# EAGLE design Temperatursensor_1.1 (EAGLE 5.04)
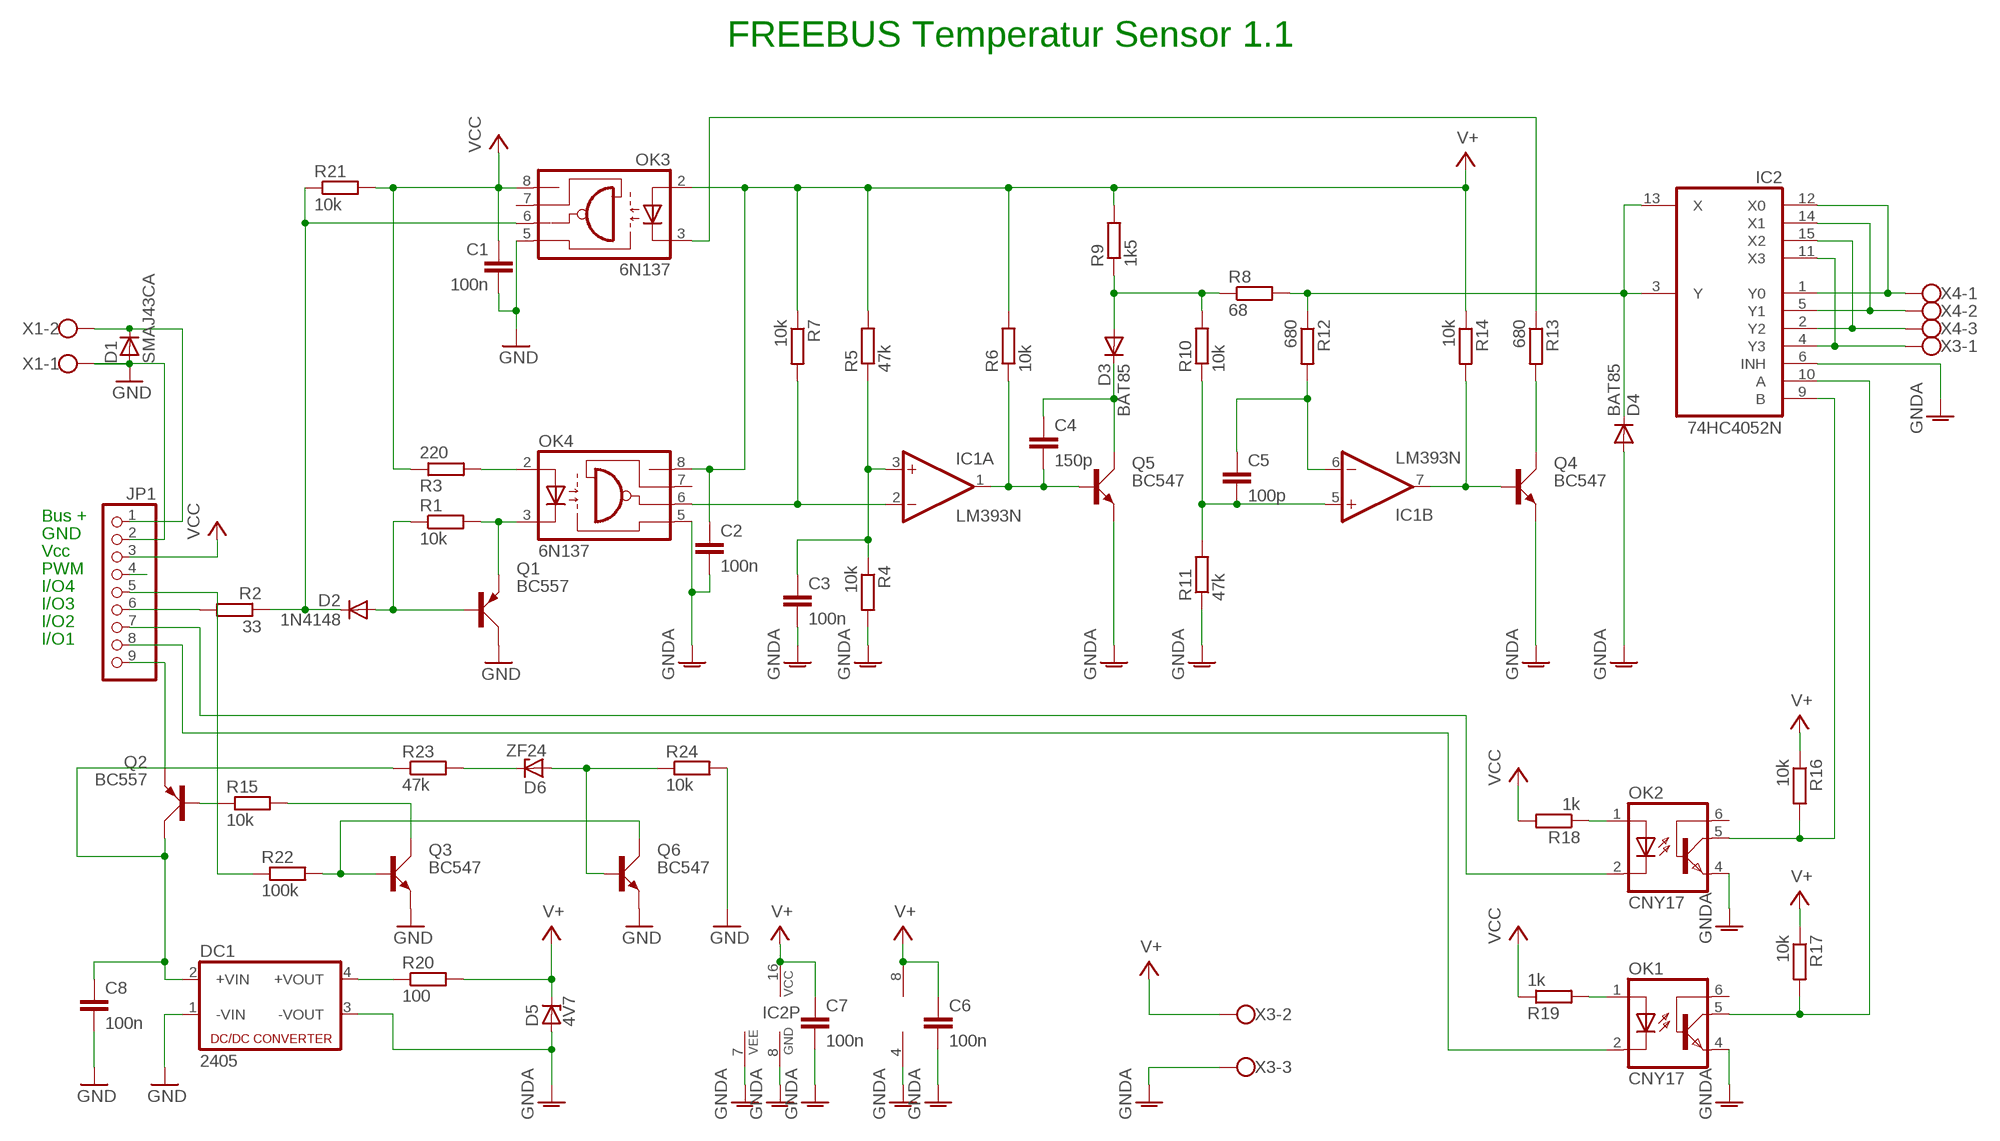
[diagram p0: schematic, sheet 1]

## Parts
C1  100n  C-EU025-024X044  [C025-024X044]
C2  100n  C-EU025-024X044  [C025-024X044]
C3  100n  C-EU025-024X044  [C025-024X044]
C4  150p  C-EU025-024X044  [C025-024X044]
C5  100p  C-EU025-024X044  [C025-024X044]
C6  100n  C-EU025-024X044  [C025-024X044]
C7  100n  C-EU025-024X044  [C025-024X044]
C8  100n  C-EU025-024X044  [C025-024X044]
D1  SMAJ43CA  D-SMB  [SMB]
D2  1N4148  DIODE-D-2.5  [D-2.5]
D3  BAT85  DIODE-D-2.5  [D-2.5]
D4  BAT85  DIODE-D-7.5  [D-7.5]
D5  4V7  ZPDSTEHEND  [ZDIODE]
D6  ZF24  ZPD  [DO35Z10]
DC1  2405  NME  [NME]
IC1  LM393N  [DIL08]
IC2  74HC4052N  4052N  [DIL16]
JP1  PINHD-1X9  [1X09]
OK1  CNY17  [DIL06]
OK2  CNY17  [DIL06]
OK3  6N137  HCPL2601  [DIL08]
OK4  6N137  HCPL2601  [DIL08]
Q1  BC557  [SOT54A]
Q2  BC557  [SOT54A]
Q3  BC547  [SOT54A]
Q4  BC547  [SOT54A]
Q5  BC547  [SOT54A]
Q6  BC547  [SOT54A]
R1  10k  R-EU_0207/2V  [0207/2V]
R2  33  R-EU_0207/2V  [0207/2V]
R3  220  R-EU_0207/2V  [0207/2V]
R4  10k  R-EU_0207/2V  [0207/2V]
R5  47k  R-EU_0207/2V  [0207/2V]
R6  10k  R-EU_0207/2V  [0207/2V]
R7  10k  R-EU_0207/2V  [0207/2V]
R8  68  R-EU_0207/2V  [0207/2V]
R9  1k5  R-EU_0207/2V  [0207/2V]
R10  10k  R-EU_0207/2V  [0207/2V]
R11  47k  R-EU_0207/2V  [0207/2V]
R12  680  R-EU_0207/2V  [0207/2V]
R13  680  R-EU_0207/2V  [0207/2V]
R14  10k  R-EU_0207/2V  [0207/2V]
R15  10k  R-EU_0207/2V  [0207/2V]
R16  10k  R-EU_0207/2V  [0207/2V]
R17  10k  R-EU_0207/2V  [0207/2V]
R18  1k  R-EU_0207/2V  [0207/2V]
R19  1k  R-EU_0207/2V  [0207/2V]
R20  100  R-EU_0207/2V  [0207/2V]
R21  10k  R-EU_0207/2V  [0207/2V]
R22  100k  R-EU_0207/2V  [0207/2V]
R23  47k  R-EU_0207/2V  [0207/2V]
R24  10k  R-EU_0207/2V  [0207/2V]
X1  W237-02P  [W237-132]
X3  W237-3E  [W237-3E]
X4  W237-3E  [W237-3E]

## Nets
GND: C1.2 C8.2 D1.2(A) DC1.1(-VIN) JP1.2 OK3.5(GND) Q1.C Q3.E Q6.E R24.2 X1.1
GNDA: C2.2 C3.2 C6.2 C7.2 D4.A D5.A DC1.3(-VOUT) IC1.4(P:V-) IC2.6(INH) IC2.7(VEE) IC2.8(GND) OK1.4(EMI) OK2.4(EMI) OK4.5(GND) Q4.E Q5.E R4.2 R11.1 X3.3
IO1: JP1.8 OK1.2(C)
IO2: JP1.7 OK2.2(C)
IO3: JP1.6 R2.2
IO4: JP1.5 R22.1
N$1: OK4.2(A) R3.2
N$2: OK4.3(C) Q1.E R1.2
N$3: D2.A Q1.B R1.1
N$4: D1.1(C) JP1.1 X1.2
N$5: D2.C OK3.6(OUT) R2.1 R21.1
N$6: IC2.1(Y0) IC2.12(X0) X4.1
N$7: IC1.2(A:-IN) OK4.6(OUT) R7.2
N$8: C8.1 DC1.2(+VIN) Q2.C R23.1
N$9: D4.C IC2.3(Y) IC2.13(X) R8.2 R12.1
N$10: D3.A R8.1 R9.1 R10.2
N$11: C3.1 IC1.3(A:+IN) R4.1 R5.1
N$12: IC2.5(Y1) IC2.14(X1) X4.2
N$13: C5.2 IC1.5(B:+IN) R10.1 R11.2
N$14: C4.2 IC1.1(A:OUT) Q5.B R6.1
N$15: C4.1 D3.C Q5.C
N$17: IC2.2(Y2) IC2.15(X2) X4.3
N$18: Q2.B R15.1
N$19: C5.1 IC1.6(B:-IN) R12.2
N$20: IC2.4(Y3) IC2.11(X3) X3.1
N$21: IC1.7(B:OUT) Q4.B R14.2
N$22: OK3.3(C) R13.1
N$23: Q4.C R13.2
N$24: IC2.9(B) OK2.5(COL) R16.2
N$25: IC2.10(A) OK1.5(COL) R17.2
N$26: Q3.C R15.2
N$27: OK2.1(A) R18.1
N$28: OK1.1(A) R19.2
N$29: DC1.4(+VOUT) R20.1
N$30: Q3.B Q6.C R22.2
N$31: D6.C R23.2
N$32: D6.A Q6.B R24.1
PWM: JP1.4
V+: C2.1 C6.1 C7.1 D5.C IC1.8(P:V+) IC2.16(VCC) OK3.2(A) OK4.8(VCC) R5.2 R6.2 R7.1 R9.2 R14.1 R16.1 R17.1 R20.2 X3.2
VCC: C1.1 JP1.3 OK3.8(VCC) R3.1 R18.2 R19.1 R21.2
VDD_IN: JP1.9 Q2.E
Unconnected: OK1.6(BAS) OK2.6(BAS) OK3.7(EN) OK4.7(EN)

## Notes on the sheet
- FREEBUS Temperatur Sensor 1.1
- Bus +
- GND
- Vcc
- PWM
- I/O4
- I/O3
- I/O2
- I/O1

## Library data of the parts
C1-C8 = resistor:C-EU: CAPACITOR, European symbol
D1 = semicon-smd-ipc:D-: DIODE unfilled
D2-D4 = diode:DIODE-: DIODE
D5 D6 = diode:ZPD: Z DIODE 500 mW
DC1 = dc-dc-converter:NME: DC-DC CONVERTER
IC1 = linear:LM393: COMPARATOR
IC2 = 40xx:4052: Dual 4-channel ANALOG MULTIPLEXER
JP1 = pinhead:PINHD-1X9: PIN HEADER
OK1 OK2 = optocoupler:CNY17: SIEMENS OPTO COUPLER
OK3 OK4 = optocoupler:HCPL2601: HEWLETT PACKARD OPTO COUPLER
Q1 Q2 = transistor-small-signal:BC557: PNP TRANSISTOR
Q3-Q6 = transistor-small-signal:BC547: NPN TRANSISTOR
R1-R24 = resistor:R-EU_: RESISTOR, European symbol
X1 = con-wago-508:W237-02P: WAGO SREW CLAMP
X3 X4 = con-wago-508:W237-3E: WAGO SREW CLAMP

## Board
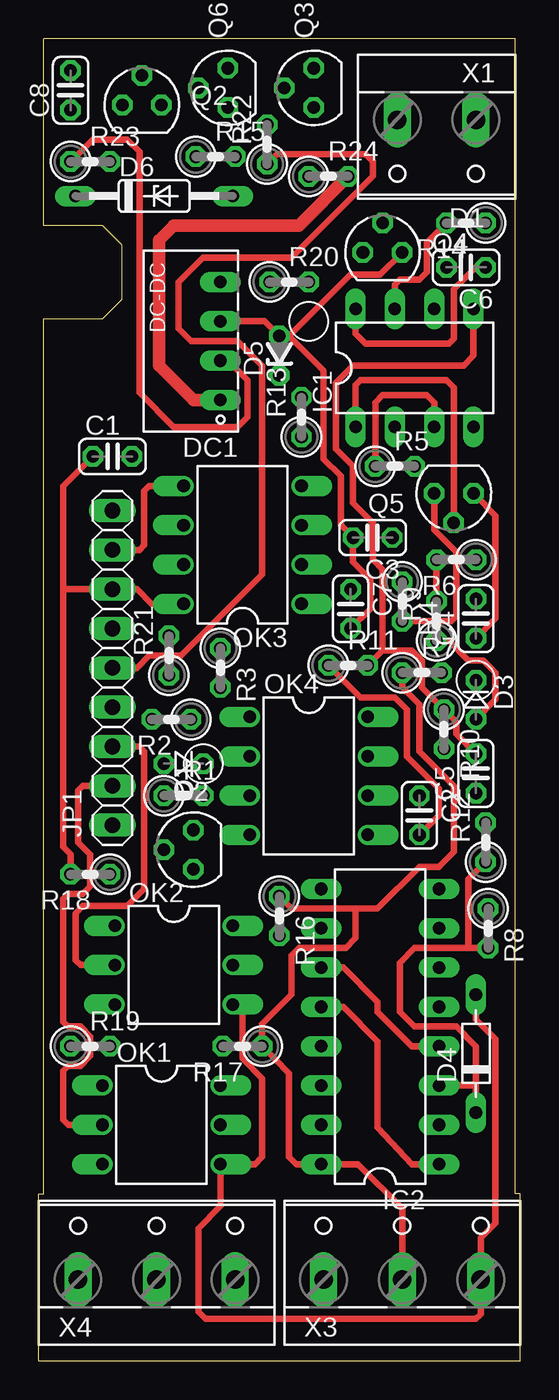
[diagram p1: board, top side]
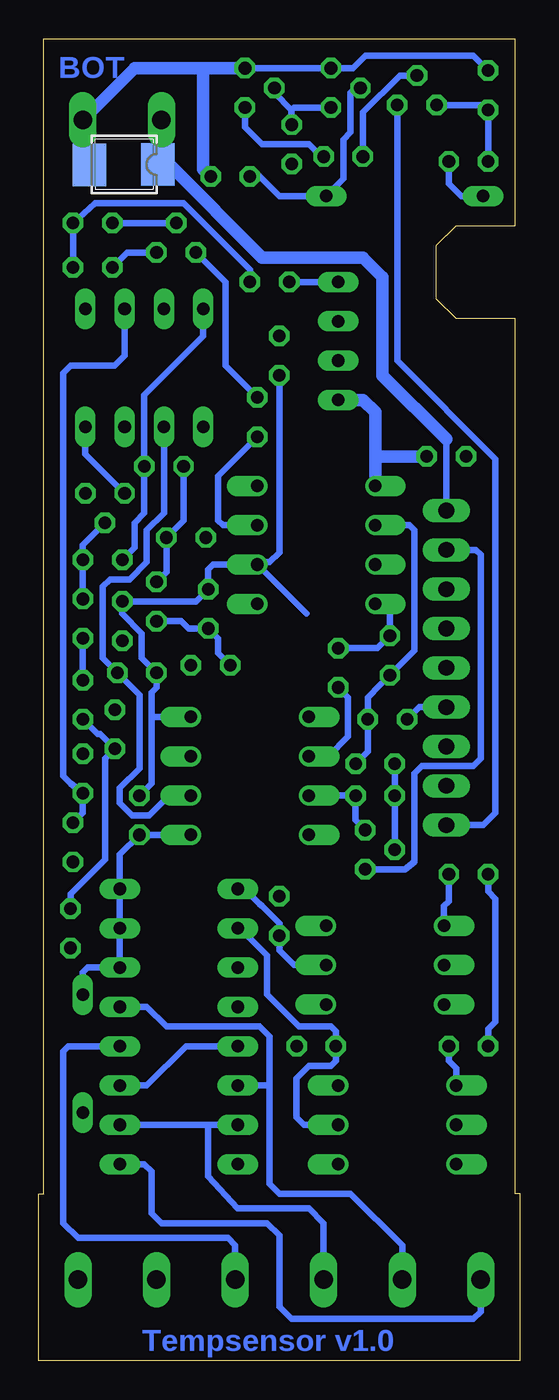
[diagram p2: board, bottom side, seen from below]

Size 31.11 x 85.41 mm. Coordinates in mm from the lower left corner, seen from the top.
Outline: 0,0 0,10.79 0.32,10.79 0.32,67.31 4.13,67.31 5.4,68.58 5.4,72.07 4.13,73.34 0.32,73.34 0.32,85.41 30.8,85.41 30.8,10.79 31.11,10.79 31.11,0 0,0
Copper layers (1*16): Top 0.035mm / dielectric 1.5mm / Bottom 0.035mm
Design rules "default *": minimum track width 10mil, minimum drill 24mil, track to track 12mil, track to pad 12mil, pad to pad 12mil, via to via 12mil, smd to smd 8mil, copper to edge 40mil, drill to drill 8mil, minimum pad ring 10mil, minimum via ring 8mil, stop-mask expansion 4mil, vias tented up to drill 0mil, thermal gap 10mil

### Footprints (pad centres in the part's own frame; a part is rotated, then mirrored left to right if it is on the bottom)
C025-024X044 = drill 0.813 octagon: 1 -1.27,0; 2 1.27,0
SMB = smd 2.159 x 2.743: 1 -2.311,-0.127; 2 2.108,-0.102
D-2.5 = drill 0.813 octagon: A 1.27,0; C -1.27,0
D-7.5 = drill 0.813 long: A 3.81,0; C -3.81,0
ZDIODE = drill 0.813 octagon: A 1.27,0; C -1.27,0
DO35Z10 = drill 0.813 long: A 5.08,0; C -5.08,0
NME = drill 0.813 long: 1 0,3.81; 2 0,1.27; 3 0,-1.27; 4 0,-3.81
DIL08 = drill 0.813 long: 1 -3.81,-3.81; 2 -1.27,-3.81; 3 1.27,-3.81; 4 3.81,-3.81; 5 3.81,3.81; 6 1.27,3.81; 7 -1.27,3.81; 8 -3.81,3.81
DIL16 = drill 0.813 long: 1 -8.89,-3.81; 2 -6.35,-3.81; 3 -3.81,-3.81; 4 -1.27,-3.81; 5 1.27,-3.81; 6 3.81,-3.81; 7 6.35,-3.81; 8 8.89,-3.81; 9 8.89,3.81; 10 6.35,3.81; 11 3.81,3.81; 12 1.27,3.81; 13 -1.27,3.81; 14 -3.81,3.81; 15 -6.35,3.81; 16 -8.89,3.81
1X09 = drill 1.016 long: 1 -10.16,0; 2 -7.62,0; 3 -5.08,0; 4 -2.54,0; 5 0,0; 6 2.54,0; 7 5.08,0; 8 7.62,0; 9 10.16,0
DIL06 = drill 0.813 offset: 1 -2.54,-3.81; 2 0,-3.81; 3 2.54,-3.81; 4 2.54,3.81; 5 0,3.81; 6 -2.54,3.81
DIL08' = drill 0.813 offset: 1 -3.81,-3.81; 2 -1.27,-3.81; 3 1.27,-3.81; 4 3.81,-3.81; 5 3.81,3.81; 6 1.27,3.81; 7 -1.27,3.81; 8 -3.81,3.81
SOT54A = drill 0.813 octagon: B 0,1.905; C -1.27,0; E 1.27,0
0207/2V = drill 0.813 octagon: 1 -1.27,0; 2 1.27,0
W237-132 = drill 1.194 long: 1 -2.54,-0.635; 2 2.54,-0.635
W237-3E = drill 1.194 long: 1 -5.08,-0.635; 2 0,-0.635; 3 5.08,-0.635

### Placement (x,y rotation side)
C1  4.76,58.42 0 top
C2  24.61,35.24 270 top
C3  21.59,53.18 180 top
C4  28.26,47.94 90 top
C5  28.26,37.94 90 top
C6  27.62,70.64 180 top
C7  20.16,48.58 270 top
C8  2.06,82.07 90 top
D1  25.72,77.15 180 bottom
D2  9.37,38.58 180 top
D3  28.26,42.7 270 top
D4  28.26,19.84 90 top
D5  15.56,64.93 90 top
D6  7.46,75.25 0 top
DC1  11.75,65.88 180 top
IC1  24.29,64.14 0 top
IC2  22.07,21.59 90 top
JP1  4.76,44.77 270 top
OK1  7.94,15.24 270 top
OK2  8.73,25.56 270 top
OK3  6N137  [DIL08']  13.18,52.71 90 top
OK4  6N137  [DIL08']  17.46,37.78 270 top
Q1  10,33.02 90 top
Q2  6.67,81.12 0 top
Q3  17.78,82.23 90 top
Q4  22.22,71.6 0 top
Q5  26.83,56.04 180 top
Q6  12.22,82.23 90 top
R1  9.37,36.51 0 top
R2  8.57,41.43 180 top
R3  11.75,44.77 270 top
R4  23.5,49.05 270 top
R5  23.02,57.79 0 top
R6  26.99,51.75 180 top
R7  24.76,44.45 0 top
R8  29.05,27.94 270 top
R9  25.72,47.78 90 top
R10  26.19,40.8 270 top
R11  20,44.93 0 top
R12  28.89,33.5 90 top
R13  16.99,60.96 90 top
R14  27.62,73.5 180 top
R15  11.43,77.79 0 top
R16  15.56,28.73 270 top
R17  13.18,20.32 180 top
R18  3.33,31.43 180 top
R19  3.33,20.32 0 top
R20  16.19,69.69 0 top
R21  8.41,45.56 90 top
R22  14.76,78.58 90 top
R23  3.33,77.47 0 top
R24  18.73,76.52 0 top
X1  25.72,79.53 180 top
X3  23.49,5.87 0 top
X4  7.62,5.87 0 top

### Tracks (layer width: path | path; a pad name or v marks a point on that pad's centre or on a via)
GND
  Top 0.406: JP1.2 6.51,52.39 6.83,52.71 6.83,56.2 7.14,56.52 OK3.5
  Top 0.813: DC1.1 10,62.07 7.78,64.29 7.78,72.39 8.73,73.34 16.83,73.34 R24.2
  Bottom 0.406: Q1.C 7.46,31.75 6.83,32.23 6.83,35.08 6.83,35.4 6.83,36.67 6.83,37.94 6.35,38.42 3.02,38.42 2.54,38.89 2.54,52.07 2.86,52.39 JP1.2 | X1.1 27.83,80.17 D1.2 27.83,80.6 | Q3.E Q6.E 10.8,83.5 10,84.3 3.02,84.3 C8.2
  Bottom 0.813: 9.37,58.42 C1.2 | 9.37,58.42 9.37,61.28 10.16,62.07 DC1.1 | OK3.5 9.37,58.42 | 27.83,80.6 24.92,83.5 20.48,83.5 | 20.48,83.5 Q3.E | 20.48,83.5 20.48,76.99 R24.2
GNDA
  Top 0.406: C7.2 21.43,48.58 21.43,50.48 20.32,51.59 C3.2 19.53,53.98 19.53,57.15 18.42,58.26 18.42,63.66 18.42,63.98 16.19,66.2 | R4.2 26.67,47.78 26.99,48.1 26.99,52.23 25.56,53.66 Q5.E | 18.42,68.42 20.16,70.17 22.07,70.17 Q4.E | Q4.E | C2.2 25.88,35.24 25.88,36.99 23.81,39.05 | 23.81,39.05 | 23.81,39.05 | 23.81,39.05 | 23.81,39.05 23.81,42.07 23.02,42.86 20.8,42.86 R11.1 | R11.1 | R11.1 | OK2.4 13.18,23.02 13.18,22.86 13.18,22.7 13.18,19.53 14.45,18.26 14.45,13.18 13.97,12.7 OK1.4 11.75,10 10.32,8.57 10.32,3.17 10.79,2.7 28.26,2.7 28.58,3.02 X3.3 28.58,7.94 29.53,8.89 29.53,20.8 28.26,22.07 28.26,23.34 D4.A | 16.19,66.2 | 16.19,66.2 D5.A 14.6,67.15 DC1.3 | DC1.3 | 18.42,68.42 | 16.19,66.2 18.42,68.42
  Bottom 0.406: OK4.5 24.45,33.97 C2.2 | C2.2 | IC2.8 25.88,32.7 C2.2 | R4.2 21.91,47.78 21.43,47.31 C7.2 19.53,46.67 19.53,45.72 R11.1 | Q4.E | C6.2 25.4,71.6 Q4.E | IC2.8 | IC2.7 IC2.8 | IC2.6 | IC2.7 | IC2.6 IC2.7 | IC2.6 27.94,25.4 28.26,25.08 D4.A | D4.A | Q5.E | Q5.E 28.1,58.58 IC1.4
IO1
  Top 0.406: JP1.8 2.86,37.15 2.54,36.83 2.54,33.5 3.33,32.7 3.33,30.64 2.86,30.16 1.9,30.16 1.59,29.84 1.59,21.91 1.9,21.59 2.7,21.59 3.33,20.95 3.33,19.68 2.7,19.05 1.9,19.05 1.59,18.73 1.59,15.56 1.9,15.24 OK1.2
IO2
  Top 0.406: JP1.7 6.51,39.69 6.83,39.37 6.83,30.48 5.71,29.37 2.86,29.37 2.38,28.89 2.38,25.88 2.7,25.56 4.13,25.56 OK2.2
IO3
  Bottom 0.406: R2.2 6.51,42.23 JP1.6 | R2.2
IO4
  Top 0.406: JP1.5 6.35,44.77 7.14,45.56 9.21,45.56 14.45,50.8 14.45,64.29 12.86,65.88 9.84,65.88 9.05,66.67 9.05,69.69 10.64,71.28 16.35,71.28 21.59,76.52 21.59,77.47 21.11,77.95 15.4,77.95 R22.1
N$1
  Bottom 0.406: OK4.2 12.38,39.05 11.11,40.32 11.11,42.86 R3.2 | R3.2
N$2
  Bottom 0.406: OK4.3 10.79,36.51 R1.2 | R1.2 | R1.2 10.64,34.92 Q1.E
N$3
  Bottom 0.406: Q1.B 8.1,37.47 | D2.A 8.1,37.78 8.1,37.47 | 8.1,37.47 R1.1
N$4
  Bottom 0.406: X1.2 23.41,80.17 D1.1 23.37,77.31 22.7,77.31 | JP1.1 4.76,59.53
  Bottom 0.813: 4.76,59.53 8.89,63.66 8.89,70.01 10.16,71.28 16.67,71.28 22.7,77.31
N$5
  Bottom 0.406: D2.C 9.84,39.37 9.84,40.48 R2.1 | OK3.6 7.14,53.98 6.83,53.66 6.83,45.88 6.99,45.72 R21.1 9.05,43.66 9.84,42.86 R2.1 | R2.1
N$6
  Top 0.406: IC2.1 24.13,12.7 21.91,15.08 21.91,20.64 19.68,22.86 IC2.12
  Bottom 0.406: X4.1 2.54,3.17 3.02,2.7 14.76,2.7 15.56,3.49 15.56,8.1 16.35,8.89 23.18,8.89 23.81,9.53 23.81,12.22 24.29,12.7 IC2.1 | IC2.1
N$7
  Bottom 0.406: OK4.6 | OK4.6 | OK4.6 22.7,36.51 23.97,35.24 25.08,35.24 25.88,36.04 25.88,36.99 24.61,38.26 24.61,43.02 R7.2 26.99,45.4 26.99,50.01 26.51,50.48 25.24,50.48 24.13,51.59 24.13,53.66 23.02,54.77 23.02,56.83 23.02,57.94 IC1.2
N$8
  Top 0.406: DC1.2 12.22,64.61 13.49,63.34 13.49,60.96 12.86,60.33 8.73,60.33 6.51,62.55 6.51,78.11 5.71,78.9 3.49,78.9 R23.1
  Bottom 0.406: R23.1 C8.1 2.38,81.12 Q2.C | R23.1
N$9
  Top 0.406: IC2.3 28.26,17.78 | 28.26,17.78 D4.C | D4.C | 28.26,17.78 28.26,20.32 26.99,21.59 24.29,21.59 23.34,22.54 23.34,25.72 24.29,26.67 26.99,26.67 27.62,26.67 R8.2 | R8.2 | R12.1 27.78,31.11 27.78,26.67 R8.2 | R8.2 | R8.2 | R8.2
  Bottom 0.406: IC2.3 24.13,17.78 21.59,20.32 IC2.13
N$10
  Top 0.406: R9.1 26.51,46.51 27.78,45.24 28.58,45.24 28.73,45.24 29.53,44.45 29.53,42.7 D3.A
  Bottom 0.406: D3.A 27.3,40.48 27.15,40.48 26.83,40.16 R10.2 26.83,38.89 26.83,35.88 | R8.1 29.05,30.16 27.78,31.43 26.83,32.38 26.83,35.88 | 26.83,35.88 26.83,35.56
N$11
  Top 0.406: R5.1 21.75,61.91 22.22,62.39 22.38,62.39 25.08,62.39 25.56,61.91 IC1.3
  Bottom 0.406: R4.1 22.86,50.96 C3.1 21.75,54.29 R5.1
N$12
  Bottom 0.406: X4.2 7.62,7.46 10.95,10.79 15.56,10.79 16.19,11.43 16.19,17.78 | 16.19,17.78 IC2.14 | IC2.5 24.13,22.86 22.86,21.59 16.83,21.59 16.19,20.95 16.19,17.78
N$13
  Top 0.406: 22.22,45.88 22.22,51.12 21.59,51.75 21.59,54.13 | 21.59,54.13 | 21.59,54.13 20.32,55.4 20.32,57.79 19.21,58.9 19.21,63.18 20.32,64.29 27.46,64.29 28.1,64.93 IC1.5 | C5.2 | C5.2 26.99,40.48 26.99,41.28 R10.1 25.4,42.86 | 25.4,42.86 | 25.4,42.86 24.77,43.5 24.77,45.24 24.13,45.88 22.22,45.88 | 22.22,45.88 R11.2 | 22.22,45.88
N$14
  Top 0.406: Q5.B 26.83,56.2 26.83,58.26 26.83,62.87 26.35,63.34 20.8,63.34 20.48,63.02 IC1.1
  Bottom 0.406: R6.1 28.26,49.85 C4.2 | R6.1 | R6.1 28.26,52.71 27.78,53.18 Q5.B
N$15
  Top 0.406: C4.1 29.53,47.94 29.53,48.26 29.53,54.61 28.26,55.88 | 28.26,55.88 Q5.C | 28.26,55.88
  Bottom 0.406: D3.C 28.26,44.45 C4.1
N$17
  Bottom 0.406: IC2.2 | 20.16,15.24 IC2.15 | 20.16,15.24 IC2.2 | X4.3 12.7,8.89 13.65,9.84 18.26,9.84 20.16,11.91 20.16,15.24
N$18
  Bottom 0.406: Q2.B 7.78,83.03 10.16,80.64 R15.1
N$19
  Bottom 0.406: IC1.6 25.56,64.93 26.19,64.29 29.05,64.29 29.53,63.82 29.53,52.23 29.53,37.78 29.05,37.31 C5.1 28.26,35.4 R12.2 | R12.2 | R12.2
N$20
  Top 0.406: IC2.4 24.13,20.32 21.91,22.54 21.91,23.18 19.68,25.4 IC2.11
  Bottom 0.406: X3.1 18.42,7.46 18.89,7.94 28.58,7.94 29.53,8.89 29.53,20 29.21,20.32 IC2.4
N$21
  Top 0.406: R14.2 25.08,72.23 25.08,70.33 24.61,69.85 23.34,69.85 23.02,69.53 IC1.7
  Bottom 0.406: Q4.B | R14.2 Q4.B
N$22
  Bottom 0.406: OK3.3 19.21,53.98 19.53,54.29 19.53,57.15 R13.1
N$23
  Bottom 0.406: R13.2 19.05,64.29 19.05,69.69 Q4.C | Q4.C
N$24
  Bottom 0.406: OK2.5 14.61,25.56 15.56,26.51 R16.2 | 15.4,27.62 | 18.1,30.48 IC2.9 17.78,30.48 16.83,29.53 16.67,29.37 15.56,28.26 R16.2 | R16.2 15.4,27.62
N$25
  Bottom 0.406: OK1.5 | OK1.5 13.97,15.24 14.45,15.72 14.45,18.26 13.65,19.05 12.22,19.05 11.91,19.37 R17.2 11.91,21.27 12.22,21.59 14.29,21.59 16.35,23.65 16.35,26.19 18.1,27.94 IC2.10
N$26
  Bottom 0.406: R15.2 12.86,77.79 13.65,78.58 16.67,78.58 17.78,79.69 Q3.C
N$27
  Bottom 0.406: R18.1 4.6,29.69 4.92,29.37 OK2.1
N$28
  Bottom 0.406: R19.2 4.6,19.37 4.13,18.89 OK1.1
N$29
  Bottom 0.406: DC1.4 R20.1
N$30
  Bottom 0.406: Q3.B 15.87,81.92 14.76,80.8 | 14.76,80.8 R22.2 | Q6.C 14.61,80.96 14.76,80.8
N$31
  Bottom 0.406: D6.C 3.81,75.25 4.6,76.04 R23.2
N$32
  Bottom 0.406: Q6.B 10.64,82.23 10.95,81.92 10.95,79.38 11.43,78.9 11.43,76.36 D6.A 15.56,75.25 16.83,76.52 R24.1
V+
  Top 0.406: X3.2 23.49,9.84 20.64,12.7 IC2.16 16.67,12.7 16.19,13.18 16.19,18.57 15.24,19.53 R17.1 14.45,21.75 16.35,23.65 16.35,26.19 16.83,26.67 19.84,26.67 20.48,27.3 20.48,29.21 | R6.2 25.72,50.01 R9.2 | 20.48,29.21 21.91,29.21 24.61,31.91 25.88,31.91 26.83,32.86 26.83,37.15 26.51,37.47 25.08,38.89 24.61,39.37 24.61,42.39 23.49,43.5 R7.1 | R7.1 | R16.1 16.35,29.21 20.48,29.21 | 20.48,29.21 | 20.48,29.21 | IC1.8 20.48,66.36 21.11,65.72 26.51,65.72 26.83,66.04 26.83,69.22 28.26,70.64 C6.1 | C6.1
  Bottom 0.406: OK3.2 19.84,51.44 20.16,51.12 C7.1 20.96,49.05 24.29,49.05 R9.2 | R7.1 24.45,45.4 24.45,46.99 25.72,48.26 25.72,48.74 R9.2 | R9.2 | C6.1 R14.1 | R6.2 24.92,52.55 24.92,54.13 24.29,54.77 24.29,58.74 | 24.29,58.74 R5.2 | 24.29,58.74 24.29,62.39 20.48,66.2 IC1.8 | R20.2 17.46,70.48 21.75,74.77 27.46,74.77 R14.1 | R14.1 | C2.1 23.81,37.31 23.81,41.59 | OK4.8 23.81,41.59 | OK4.8 | 23.81,41.59 23.81,43.18 23.49,43.5 R7.1 | R7.1 | OK3.2 13.81,48.26 | D5.C 15.56,52.23 16.19,51.59 16.83,51.59 OK3.2
VCC
  Top 0.406: R18.2 | R18.2 2.06,32.7 1.59,33.18 1.59,49.85 | 1.59,49.85 JP1.3 6.35,49.85 7.3,48.9 OK3.8 | C1.1 1.59,56.52 1.59,49.85
  Bottom 0.406: R19.1 2.06,21.43 1.59,21.91 1.59,29.84 2.06,30.32 R18.2 | R3.1 9.21,46.04 R21.2 8.41,48.9 OK3.8
VDD_IN
  Bottom 0.406: 7.94,64.61 1.59,58.26 1.59,35.4 2.38,34.61 JP1.9 | 7.94,64.61 Q2.E | 7.94,64.61

### Text on the board
Bottom: BOT | Tempsensor v1.0